# Altium schematic sheet 04_Seven_Seg.SchDoc: ECE315 Analog
size A; Date: 4/25/2017; ApprovedBy: JSK; CheckedBy: JSK; Author: JSK; CompanyName: University of Wisconsin; DrawnBy: JSK; Engineer: JSK; Organization: ECE 315; Address1: College of Engineering; Address2: 1415 Engineering Drive; Address3: Madison, WI 53706; Address4: ECE 315 Fall 2017; Revision: A; SheetNumber: 2; SheetTotal: 2; AssemblyNumber: ECE315-F19; ApprovedDate: 04/02/2019
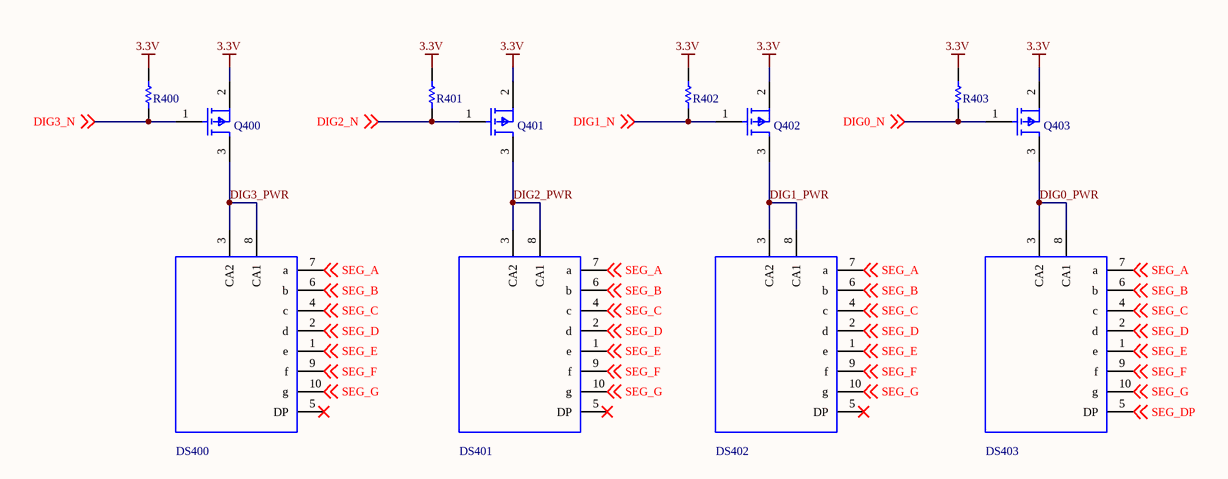
[diagram p0: 04_Seven_Seg.SchDoc]

## Parts
DS400  ACSA56-41CGKWA-F01  [ACSA56-41CGKWA-F01]  (value not drawn)
DS401  ACSA56-41CGKWA-F01  [ACSA56-41CGKWA-F01]  (value not drawn)
DS402  ACSA56-41CGKWA-F01  [ACSA56-41CGKWA-F01]  (value not drawn)
DS403  ACSA56-41CGKWA-F01  [ACSA56-41CGKWA-F01]  (value not drawn)
Q400  SSM3J328R,LF  [SOT-23_M]  (value not drawn)
Q401  SSM3J328R,LF  [SOT-23_M]  (value not drawn)
Q402  SSM3J328R,LF  [SOT-23_M]  (value not drawn)
Q403  SSM3J328R,LF  [SOT-23_M]  (value not drawn)
R400  RES_0805_K_010.00  [RES_0805]  (value not drawn)
R401  RES_0805_K_010.00  [RES_0805]  (value not drawn)
R402  RES_0805_K_010.00  [RES_0805]  (value not drawn)
R403  RES_0805_K_010.00  [RES_0805]  (value not drawn)

## Nets
3.3V: Q400.2(Source) Q401.2(Source) Q402.2(Source) Q403.2(Source) R400.2 R401.2 R402.2 R403.2
DIG0_N: Q403.1(Gate) R403.1 ; off-sheet DIG0_N
DIG0_PWR: DS403.3(CA2) DS403.8(CA1) Q403.3(Drain)
DIG1_N: Q402.1(Gate) R402.1 ; off-sheet DIG1_N
DIG1_PWR: DS402.3(CA2) DS402.8(CA1) Q402.3(Drain)
DIG2_N: Q401.1(Gate) R401.1 ; off-sheet DIG2_N
DIG2_PWR: DS401.3(CA2) DS401.8(CA1) Q401.3(Drain)
DIG3_N: Q400.1(Gate) R400.1 ; off-sheet DIG3_N
DIG3_PWR: DS400.3(CA2) DS400.8(CA1) Q400.3(Drain)
SEG_A: DS400.7(a) DS401.7(a) DS402.7(a) DS403.7(a) ; off-sheet SEG_A
SEG_B: DS400.6(b) DS401.6(b) DS402.6(b) DS403.6(b) ; off-sheet SEG_B
SEG_C: DS400.4(c) DS401.4(c) DS402.4(c) DS403.4(c) ; off-sheet SEG_C
SEG_D: DS400.2(d) DS401.2(d) DS402.2(d) DS403.2(d) ; off-sheet SEG_D
SEG_DP: DS403.5(DP) ; off-sheet SEG_DP
SEG_E: DS400.1(e) DS401.1(e) DS402.1(e) DS403.1(e) ; off-sheet SEG_E
SEG_F: DS400.9(f) DS401.9(f) DS402.9(f) DS403.9(f) ; off-sheet SEG_F
SEG_G: DS400.10(g) DS401.10(g) DS402.10(g) DS403.10(g) ; off-sheet SEG_G

Not connected (* = marked no-connect by the designer): DS400 5(DP)*; DS401 5(DP)*; DS402 5(DP)*

## Library data of the parts
DS400-DS403 = ACSA56-41CGKWA-F01: DISPLAY 0.56" SGL 574NM GRN SMD; Manufacturer 1: Kingbright; Color: Green; Power Consumption: 75mW; Number of Characters: 1; Element Configuration: Common Anode; Forward Current: 30mA; Forward Voltage: 2.1V; Wavelength: 570nm; Test Current: 20mA; Luminous Intensity: 25mcd; Display Type: Segment; Supplier 1: Digi-Key; Supplier Part Number 1: 754-1033-1-ND; Manufacturer Part Number 1: ACSA56-41CGKWA-F01; RoHS: Yes; Category: LED Displays; Stock 1: 38128; Pricing 1: 1=3.38000, 10=2.25300, 100=1.73360 (USD); Case/Package: SMD/SMT; Min Operating Temperature: -40°C; Max Operating Temperature: 85°C; Package Quantity: 400; Max Power Dissipation: 75mW; Illumination Color: Green; Packaging: Rail/Tube; Operating Supply Voltage: 2.1V; Width: 0.488inch; Height: 0.669inch; RoHS Compliant: Yes; Lead Free: Lead Free; ComponentLink1URL: https://datasheet.ciiva.com/2103/acsa56-41cgkwa-f01-2103794.pdf?src-supplier=Digi-Key; ComponentLink1Description: https://datasheet.ciiva.com/2103/acsa56-41cgkwa-f01-2103794.pdf?src-supplier=Digi-Key; ComponentLink2URL: https://datasheet.ciiva.com/4421/acsa56-41cgkwa-f01-17964-4421697.pdf?src-supplier=Mouser; ComponentLink2Description: https://datasheet.ciiva.com/4421/acsa56-41cgkwa-f01-17964-4421697.pdf?src-supplier=Mouser; ComponentLink3URL: https://datasheet.ciiva.com/16287/acsa56-41cgkwa-f01-16287523.pdf?src-supplier=Future+Electronics; ComponentLink3Description: https://datasheet.ciiva.com/16287/acsa56-41cgkwa-f01-16287523.pdf?src-supplier=Future+Electronics; ComponentLink4URL: https://datasheet.ciiva.com/2103/acsa56-41cgkwa-f01-2103795.pdf?src-supplier=Digi-Key; ComponentLink4Description: https://datasheet.ciiva.com/2103/acsa56-41cgkwa-f01-2103795.pdf?src-supplier=Digi-Key; ComponentLink5URL: https://datasheet.ciiva.com/2103/acsa56-41cgkwa-f01-2103796.pdf?src-supplier=Digi-Key; ComponentLink5Description: https://datasheet.ciiva.com/2103/acsa56-41cgkwa-f01-2103796.pdf?src-supplier=Digi-Key
Q400-Q403 = SSM3J328R,LF: MOSFET P-CH 20V 6A SOT23F; Manufacturer 1: Toshiba; Rds On Max: 29.8mR; Input Capacitance: 840pF; Max Power Dissipation: 1W; Gate to Source Voltage (Vgs): 8V; Turn-Off Delay Time: 107ns; Turn-On Delay Time: 32ns; Number of Channels: 1; Drain to Source Resistance: 47.4mR; Power Dissipation: 2W; Element Configuration: Single; Drain to Source Breakdown Voltage: -20V; Polarity: P-CHANNEL; Supplier 1: Digi-Key; Supplier Part Number 1: SSM3J328RLFCT-ND; Manufacturer Part Number 1: SSM3J328R,LF; RoHS: Yes; Category: MOSFETs; Stock 1: 476474; Pricing 1: 1=0.43000, 10=0.32200, 25=0.29040, 100=0.20060, 500=0.13728, 1000=0.10560 (USD); Mount: Surface Mount; Case/Package: SOT-23-3; Number of Pins: 3; Min Operating Temperature: -55°C; Max Operating Temperature: 150°C; Package Quantity: 3000; Packaging: Tape and Reel; Drain to Source Voltage (Vdss): 20V; Continuous Drain Current (ID): 6A; Number of Elements: 1; Radiation Hardening: No; RoHS Compliant: Yes; ComponentLink1URL: https://datasheet.ciiva.com/11158/ssm3j328r-datasheet-en-20140301-11158652.pdf?src-supplier=Avnet; ComponentLink1Description: https://datasheet.ciiva.com/11158/ssm3j328r-datasheet-en-20140301-11158652.pdf?src-supplier=Avnet; ComponentLink2URL: https://datasheet.ciiva.com/24106/ssm3j328r-datasheet-en-20140301-24106699.pdf?src-supplier=Mouser; ComponentLink2Description: https://datasheet.ciiva.com/24106/ssm3j328r-datasheet-en-20140301-24106699.pdf?src-supplier=Mouser; ComponentLink3URL: https://datasheet.ciiva.com/45425/ssm3j328r-datasheet-en-20140301-45425519.pdf?src-supplier=Digi-Key; ComponentLink3Description: https://datasheet.ciiva.com/45425/ssm3j328r-datasheet-en-20140301-45425519.pdf?src-supplier=Digi-Key; ComponentLink4URL: https://datasheet.ciiva.com/45425/ssm3j328r-datasheet-en-20140301-45425813.pdf?src-supplier=Digi-Key; ComponentLink4Description: https://datasheet.ciiva.com/45425/ssm3j328r-datasheet-en-20140301-45425813.pdf?src-supplier=Digi-Key
R400-R403 = RES_0805_K_010.00: RES SMD 10K OHM 1% 1/8W 0805; Manufacturer 1: Yageo; Manufacturer Part Number 1: RC0805FR-0710KL; Temperature Coefficient: 100ppm/°C; Power Rating: 125mW; Voltage Rating: 150V; Resistance: 10kR; Supplier 1: Digi-Key; Supplier Part Number 1: 311-10.0KCRCT-ND; Stock 1: 7562122; Pricing 1: 1=0.10000, 10=0.04200, 100=0.01690, 1000=0.00759, 2500=0.00659 (USD); RoHS: Yes; Case/Package: 0805; Case Code (Imperial): 0805; Case Code (Metric): 2012; Min Operating Temperature: -55°C; Max Operating Temperature: 155°C; Tolerance: 1%; Packaging: Tape and Reel; Features: Moisture Resistant; Termination: SMD/SMT; Number of Terminations: 2; Military Standard: Not; Max Power Dissipation: 125mW; Package Quantity: 1; Length: 2mm; Height: 0.024inch; Width: 0.049inch; Depth: 1.25mm; Lead Free: Lead Free; REACH SVHC: Unknown; ComponentLink1URL: https://datasheet.ciiva.com/11808/0900766b8106beab-11808151.pdf?src-supplier=RSComponents; ComponentLink1Description: https://datasheet.ciiva.com/11808/0900766b8106beab-11808151.pdf?src-supplier=RSComponents; ComponentLink2URL: https://datasheet.ciiva.com/12669/rc0805-12669688.pdf?src-supplier=Mouser; ComponentLink2Description: https://datasheet.ciiva.com/12669/rc0805-12669688.pdf?src-supplier=Mouser; ComponentLink3URL: https://datasheet.ciiva.com/46447/444164-46447563.pdf?src-supplier=Element14; ComponentLink3Description: https://datasheet.ciiva.com/46447/444164-46447563.pdf?src-supplier=Element14; ComponentLink4URL: https://datasheet.ciiva.com/2456/pyu-r-int-thick-7-2456972.pdf?src-supplier=Digi-Key; ComponentLink4Description: https://datasheet.ciiva.com/2456/pyu-r-int-thick-7-2456972.pdf?src-supplier=Digi-Key; ComponentLink5URL: https://datasheet.ciiva.com/2456/pyu-r-int-thick-7-2456973.pdf?src-supplier=Digi-Key; ComponentLink5Description: https://datasheet.ciiva.com/2456/pyu-r-int-thick-7-2456973.pdf?src-supplier=Digi-Key; ComponentLink6URL: https://datasheet.ciiva.com/2456/pyu-r-int-thick-7-2456974.pdf?src-supplier=Digi-Key; ComponentLink6Description: https://datasheet.ciiva.com/2456/pyu-r-int-thick-7-2456974.pdf?src-supplier=Digi-Key; ComponentLink7URL: https://datasheet.ciiva.com/16747/rc0805-16747087.pdf?src-supplier=Future+Electronics; ComponentLink7Description: https://datasheet.ciiva.com/16747/rc0805-16747087.pdf?src-supplier=Future+Electronics; Category: Chip SMD Resistors; Size Code: 0805; Resistor Type: Thick Film; Series: RC; Construction: Rectangular; Resistance Tolerance: 1%; Technology: THICK FILM; RoHS Compliant: Yes